# Altium schematic sheet DAC.SchDoc
size A3; SheetNumber: 3; SheetTotal: 8
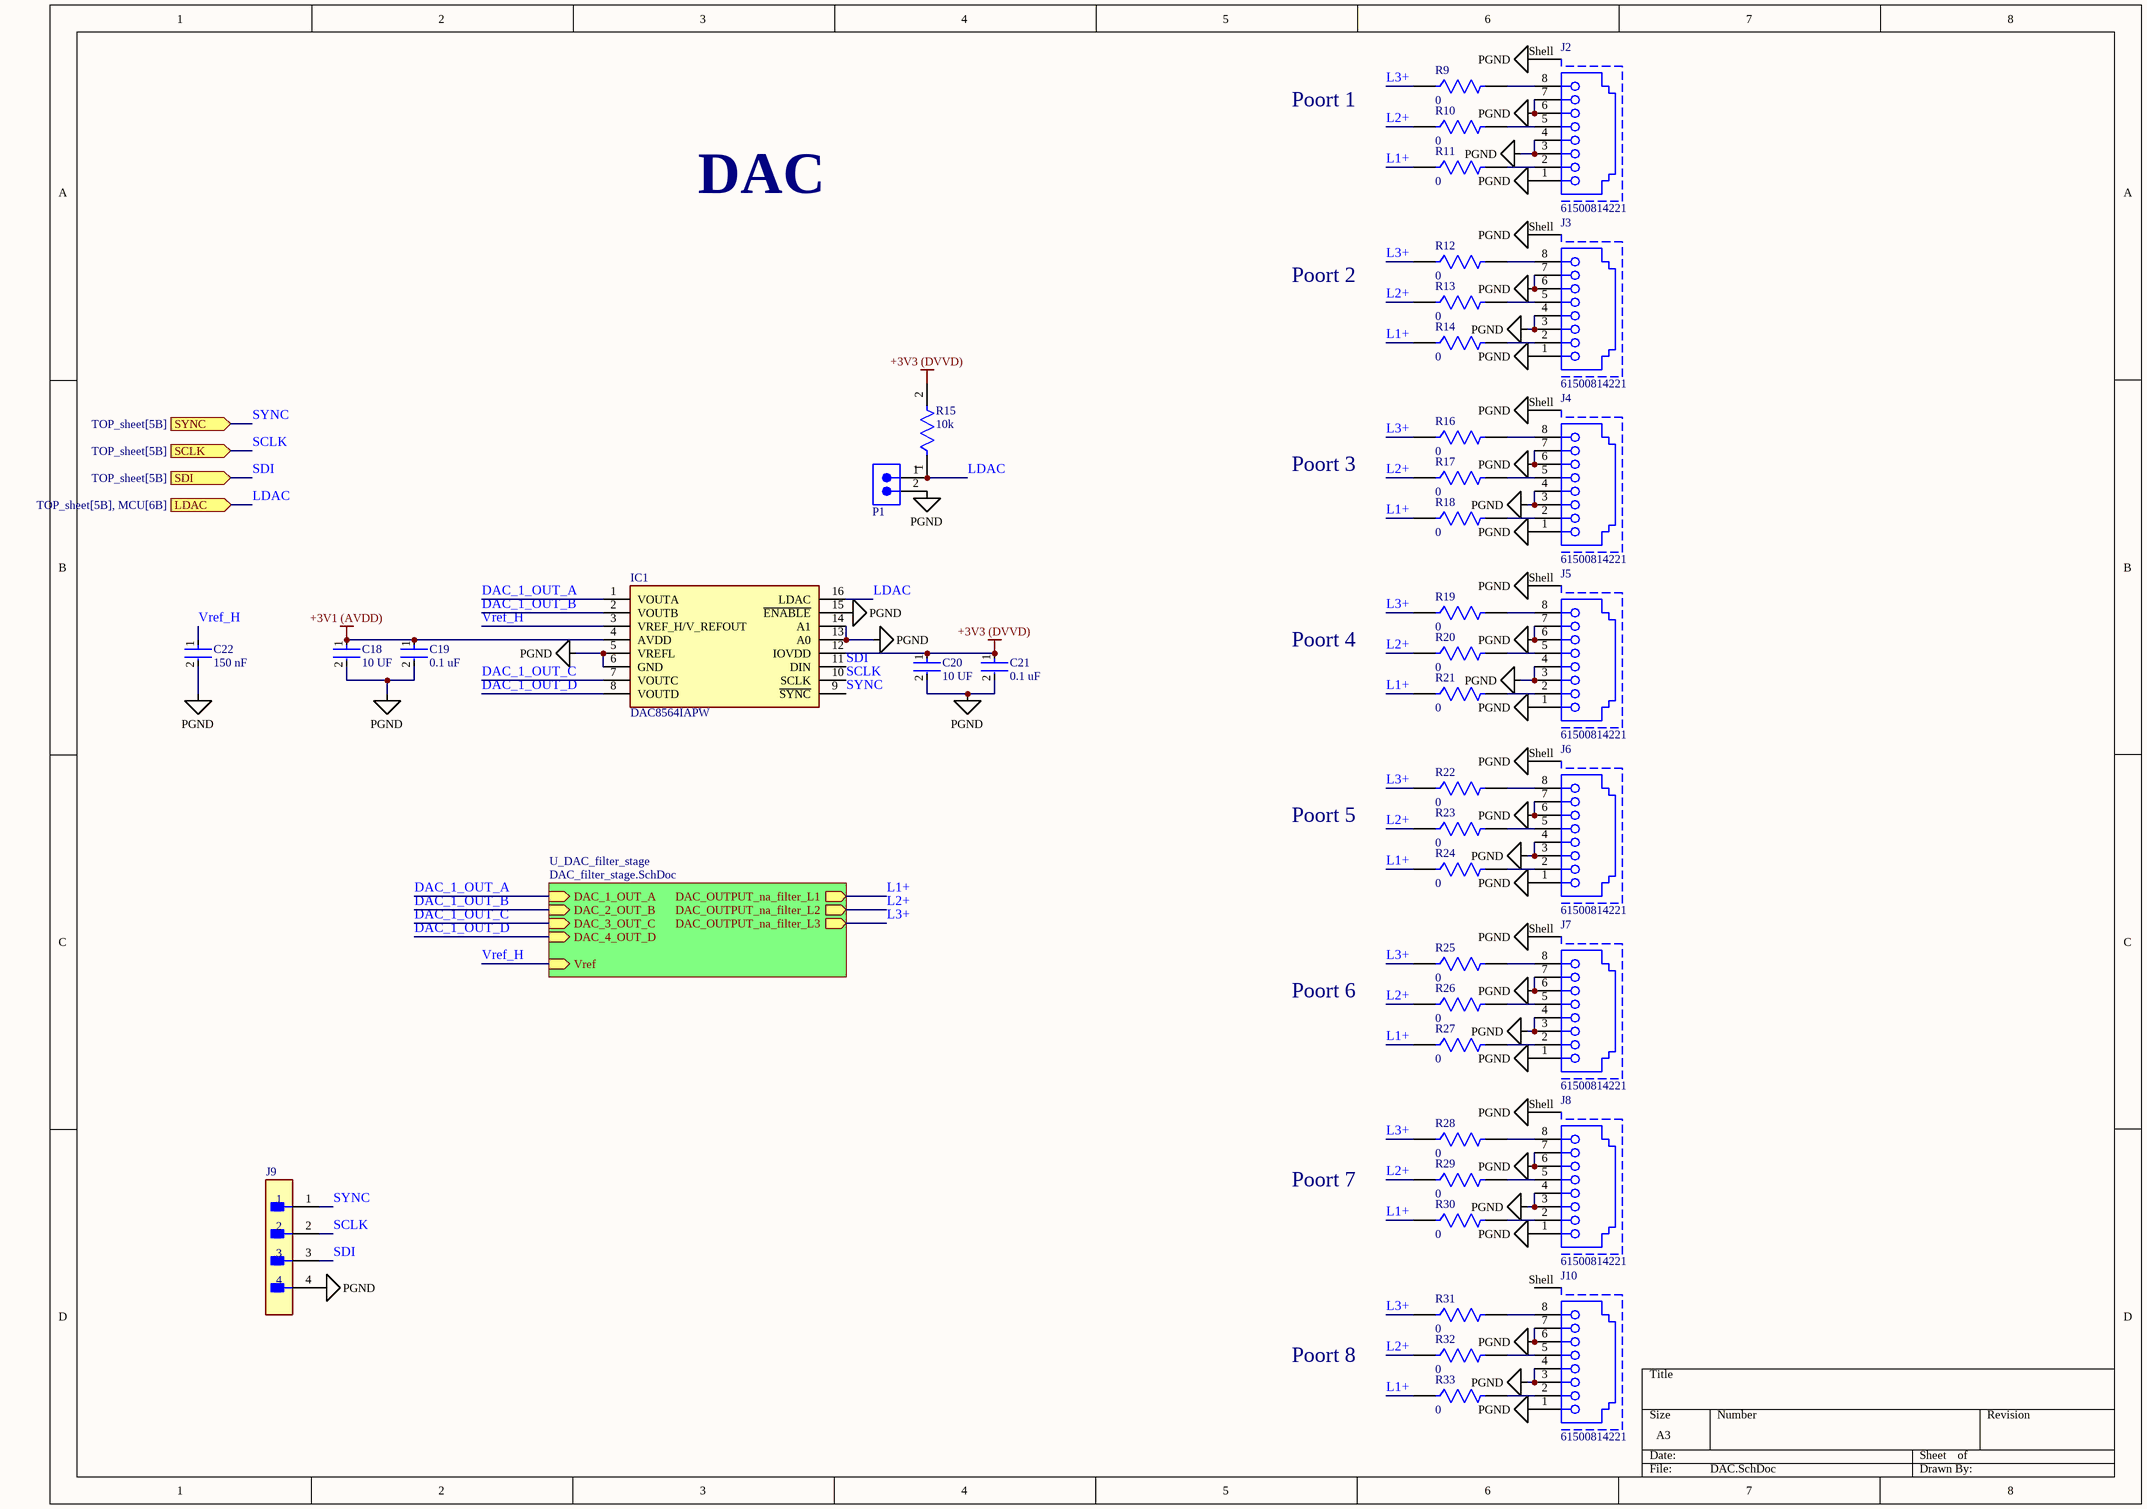
[diagram p0: DAC.SchDoc]

## Parts
C18  10 UF  [FP-CC0603-DA-MFG]
C19  0.1 uF  [FP-CC0603-DA-MFG]
C20  10 UF  [FP-CC0603-DA-MFG]
C21  0.1 uF  [FP-CC0603-DA-MFG]
C22  150 nF  [FP-CC0603-DA-MFG]
IC1  DAC8564IAPW  [SOP65P640X120-16N]
J2  61500814221  [61500814221]
J3  61500814221  [61500814221]
J4  61500814221  [61500814221]
J5  61500814221  [61500814221]
J6  61500814221  [61500814221]
J7  61500814221  [61500814221]
J8  61500814221  [61500814221]
J9  TSW-104-22-G-S  [FP-TSW-104-22-G-S-MFG]  (value not drawn)
J10  61500814221  [61500814221]
P1  TSW-102-26-T-S  [SMTC-TSW-102-26-XX-S]  (value not drawn)
R9  0  [FP-CRCW1206-MFG]
R10  0  [FP-CRCW1206-MFG]
R11  0  [FP-CRCW1206-MFG]
R12  0  [FP-CRCW1206-MFG]
R13  0  [FP-CRCW1206-MFG]
R14  0  [FP-CRCW1206-MFG]
R15  10k  [FP-RC1608-IPC_B]
R16  0  [FP-CRCW1206-MFG]
R17  0  [FP-CRCW1206-MFG]
R18  0  [FP-CRCW1206-MFG]
R19  0  [FP-CRCW1206-MFG]
R20  0  [FP-CRCW1206-MFG]
R21  0  [FP-CRCW1206-MFG]
R22  0  [FP-CRCW1206-MFG]
R23  0  [FP-CRCW1206-MFG]
R24  0  [FP-CRCW1206-MFG]
R25  0  [FP-CRCW1206-MFG]
R26  0  [FP-CRCW1206-MFG]
R27  0  [FP-CRCW1206-MFG]
R28  0  [FP-CRCW1206-MFG]
R29  0  [FP-CRCW1206-MFG]
R30  0  [FP-CRCW1206-MFG]
R31  0  [FP-CRCW1206-MFG]
R32  0  [FP-CRCW1206-MFG]
R33  0  [FP-CRCW1206-MFG]

## Sub-sheets
U_DAC_filter_stage = DAC_filter_stage.SchDoc: DAC_1_OUT_A (in), DAC_2_OUT_B (in), DAC_3_OUT_C (in), DAC_4_OUT_D (in), DAC_OUTPUT_na_filter_L2 (out), DAC_OUTPUT_na_filter_L1 (out), DAC_OUTPUT_na_filter_L3 (out), Vref (in)

## Ports
LDAC (in, see TOP_sheet[5B], MCU[6B]), SCLK (in, see TOP_sheet[5B]), SDI (in, see TOP_sheet[5B]), SYNC (in, see TOP_sheet[5B])

## Nets
+3V1 (AVDD): C18.1 C19.1 IC1.4(AVDD)
+3V3 (DVVD): C20.1 C21.1 IC1.12(IOVDD) R15.2
PGND: C18.2 C19.2 C20.2 C21.2 C22.2 IC1.5(VREFL) IC1.6(GND) IC1.13(A0) IC1.14(A1) IC1.15(~{ENABLE}) J2.1 J2.3 J2.4 J2.6 J2.7 J2.Shell J3.1 J3.3 J3.4 J3.6 J3.7 J3.Shell J4.1 J4.3 J4.4 J4.6 J4.7 J4.Shell J5.1 J5.3 J5.4 J5.6 J5.7 J5.Shell J6.1 J6.3 J6.4 J6.6 J6.7 J6.Shell J7.1 J7.3 J7.4 J7.6 J7.7 J7.Shell J8.1 J8.3 J8.4 J8.6 J8.7 J8.Shell J9.4 J10.1 J10.3 J10.4 J10.6 J10.7 P1.2
DAC_1_OUT_A: IC1.1(VOUTA) ; sheet U_DAC_filter_stage/DAC_1_OUT_A
DAC_1_OUT_B: IC1.2(VOUTB) ; sheet U_DAC_filter_stage/DAC_2_OUT_B
DAC_1_OUT_C: IC1.7(VOUTC) ; sheet U_DAC_filter_stage/DAC_3_OUT_C
DAC_1_OUT_D: IC1.8(VOUTD) ; sheet U_DAC_filter_stage/DAC_4_OUT_D
L1+: R11.1 R14.1 R18.1 R21.1 R24.1 R27.1 R30.1 R33.1 ; sheet U_DAC_filter_stage/DAC_OUTPUT_na_filter_L1
L2+: R10.1 R13.1 R17.1 R20.1 R23.1 R26.1 R29.1 R32.1 ; sheet U_DAC_filter_stage/DAC_OUTPUT_na_filter_L2
L3+: R9.1 R12.1 R16.1 R19.1 R22.1 R25.1 R28.1 R31.1 ; sheet U_DAC_filter_stage/DAC_OUTPUT_na_filter_L3
LDAC: IC1.16(LDAC) P1.1 R15.1 ; port LDAC
SCLK: IC1.10(SCLK) J9.2 ; port SCLK
SDI: IC1.11(DIN) J9.3 ; port SDI
SYNC: IC1.9(~{SYNC}) J9.1 ; port SYNC
Vref_H: C22.1 IC1.3(VREF_H/V_REFOUT) ; sheet U_DAC_filter_stage/Vref
NetJ2_2: J2.2 R11.2
NetJ2_5: J2.5 R10.2
NetJ2_8: J2.8 R9.2
NetJ3_2: J3.2 R14.2
NetJ3_5: J3.5 R13.2
NetJ3_8: J3.8 R12.2
NetJ4_2: J4.2 R18.2
NetJ4_5: J4.5 R17.2
NetJ4_8: J4.8 R16.2
NetJ5_2: J5.2 R21.2
NetJ5_5: J5.5 R20.2
NetJ5_8: J5.8 R19.2
NetJ6_2: J6.2 R24.2
NetJ6_5: J6.5 R23.2
NetJ6_8: J6.8 R22.2
NetJ7_2: J7.2 R27.2
NetJ7_5: J7.5 R26.2
NetJ7_8: J7.8 R25.2
NetJ8_2: J8.2 R30.2
NetJ8_5: J8.5 R29.2
NetJ8_8: J8.8 R28.2
NetJ10_2: J10.2 R33.2
NetJ10_5: J10.5 R32.2
NetJ10_8: J10.8 R31.2

Not connected (* = marked no-connect by the designer): J10 Shell

## Notes on the sheet
- Poort 1
- DAC
- Poort 2
- Poort 3
- Poort 4
- Poort 5
- Poort 6
- Poort 7
- Poort 8

## Library data of the parts
C18 C20 = CMP-2000-05002-2: CAP CER 10 UF 16V X7R 0603; Manufacturer Part Number: CC0603KRX7R7BB104; Manufacturer: YAGEO; Tolerance: 0.1; Value: 100 nF; Temperature Coefficient: 15%; Material: Ceramic; Voltage Rating: 16 V; Package: CC0603-DA; ComponentLink2Description: Datasheet; Octopart: https://octopart.com/cc0603krx7r7bb104-yageo-192941; Temperature Range High: +125°C; Digikey Description: CAP CER 0.1UF 16V X7R 0603; Voltage: 16 V; Device Class L2: Capacitors; Height: 0.9mm; Temperature: -55°C to +125°C; Device Class L1: Passive Components; Device Class L3: Ceramic Capacitors; ComponentLink2URL: http://www.yageo.com/documents/recent/UPY-GPHC_X7R_6.3V-to-50V_18.pdf; Footprint Url: http://www.yageo.com/exep/pages/download/literatures/UPY-C_GEN_24.pdf; RoHS: TRUE; Temperature Range Low: -55°C; Temperature Characteristic: X7R; Lead Free: Yes; Capacitance: 100 nF; Category: Cap; Mouser Description: Multilayer Ceramic Capacitor, CC Series, 0.1 - F, - 10%, X7R, 16 V, 0603 [1608 Metric]; Automotive: No
C19 C21 C22 = CMP-2000-05002-2: CAP CER 0.1UF 16V X7R 0603; Manufacturer Part Number: CC0603KRX7R7BB104; Manufacturer: YAGEO; Tolerance: 0.1; Value: 100 nF; Temperature Coefficient: 15%; Material: Ceramic; Voltage Rating: 16 V; Package: CC0603-DA; ComponentLink2Description: Datasheet; Octopart: https://octopart.com/cc0603krx7r7bb104-yageo-192941; Temperature Range High: +125°C; Digikey Description: CAP CER 0.1UF 16V X7R 0603; Voltage: 16 V; Device Class L2: Capacitors; Height: 0.9mm; Temperature: -55°C to +125°C; Device Class L1: Passive Components; Device Class L3: Ceramic Capacitors; ComponentLink2URL: http://www.yageo.com/documents/recent/UPY-GPHC_X7R_6.3V-to-50V_18.pdf; Footprint Url: http://www.yageo.com/exep/pages/download/literatures/UPY-C_GEN_24.pdf; RoHS: TRUE; Temperature Range Low: -55°C; Temperature Characteristic: X7R; Lead Free: Yes; Capacitance: 100 nF; Category: Cap; Mouser Description: Multilayer Ceramic Capacitor, CC Series, 0.1 - F, - 10%, X7R, 16 V, 0603 [1608 Metric]; Automotive: No
IC1 = DAC8564IAPW: Integrated Circuit; Manufacturer_Name: Texas Instruments; Datasheet Link: http://www.ti.com/lit/gpn/dac8564; Height: 1.2mm; Manufacturer_Part_Number: DAC8564IAPW; Mouser Part Number: 595-DAC8564IAPW; Mouser Price/Stock: https://www.mouser.co.uk/ProductDetail/Texas-Instruments/DAC8564IAPW?qs=xL7PkI2RoJ7hkn2IPLSbKw%3D%3D; Arrow Part Number: DAC8564IAPW; Arrow Price/Stock: https://www.arrow.com/en/products/dac8564iapw/texas-instruments?region=nac
J2-J8 J10 = CMP-1502-01695-2: NexarPartId: 8917800; Number of Contacts: 8; Operating Supply Voltage: 120V; Gender: Female; Contact Resistance: 20mΩ; Number of Ports: 1; Direction: Down; Shielding: Shielded; Insulation Resistance: 500MΩ; Current Rating: 1.5A; Connector Type: RJ45, Socket; Mount: PCB, Through Hole; Housing Material: PBT; RoHS: Compliant; Depth: 21.2mm; Max Operating Temperature: 85°C; Contact Material: Copper; REACH SVHC: Unknown; Voltage Rating (DC): 120V; Orientation: Right Angle; Number of Positions: 8; Number of Rows: 1; Insulation Material: PBT; Width: 15.88mm; Flammability Rating: UL94 V-0; Termination: Through Hole; Min Operating Temperature: -40°C; Voltage Rating (AC): 120V; Length: 13.65mm; Height: 19.95mm; Contact Plating: Gold; Color: Black
J9 = CMP-02766-001236-1: GENERIC PART NUMBER: GPHA-1X04 / CONN HEADER VERT 4POS 2.54MM; Number of Contacts: 4; Gender: Male; Termination: Solder; Pitch: 2.54mm; Mount: Through Hole; Number of Rows: 1; Packaging: Bulk; Contact Material: Bronze; Contact Plating: Gold; REACH SVHC: No SVHC; Radiation Hardening: No; GENERIC PART NUMBER: GPHA-1X04
P1 = CMP-1024-00328-1: 0.025" SQ Post Header, Through-hole, Vertical, -55 to 105 degC, 2.54 mm Pitch, 2-Pin, Male, RoHS; Manufacturer: Samtec; Pitch: 2.54 mm; PackageReference: TSW-102-26-XX-S; ComponentLink1URL: http://www.samtec.com; ComponentLink3Description: Package Specification; ComponentLink3URL: http://www.samtec.com/documents/webfiles/cpdf/TSW-XXX-XX-XXX-X-XX-XXX-MKT.pdf; DatasheetVersion: F-214; ComponentLink2URL: http://www.samtec.com/documents/webfiles/pdf/TSW_TH.PDF; Mounting Technology: Through-hole; ComponentLink2Description: Datasheet; PartNumber: TSW-102-26-T-S; ComponentLink1Description: Manufacturer URL; PackageDescription: .025[0.64] SQ. Post Terminal Strip Assembly; Orientation: Vertical; PackageVersion: DM, 8/1988; Temperature Range: -55 to 105 degC; RoHS: True
R9-R14 R16-R33 = CMP-00030-39388935-1: CRCW12060000ZSTA Zero Ohm Resistor, Jumper, 1206 [3216 Metric], Thick Film, 250 mW, Surface Mount; Voltage Rating (DC): 200V; Max Power Dissipation: 250mW; Temperature Coefficient: 100ppm/°C; Resistance: 0Ω; Packaging: Cut Tape; Lead Free: Contains Lead; Height: 609.6µm; Military Standard: Not; Min Operating Temperature: -55°C; Weight: 10.007382mg; Depth: 1.6mm; Termination: SMD/SMT; Mount: Surface Mount; RoHS: Compliant; Case Code (Metric): 3216; Max Operating Temperature: 155°C; NexarPartId: 39388935; Length: 3.2mm; Features: Automotive AEC-Q200; Case Code (Imperial): 1206; Composition: Thick Film; Case/Package: 1206; Voltage Rating: 200V; Width: 1.6mm; Contact Plating: Lead, Tin; Number of Terminations: 2; REACH SVHC: Unknown; Power Rating: 250mW; Radiation Hardening: No
R15 = CMP-13261-004935-1: Res Thick Film 0603 11kΩ 1% 0.1W ±100ppm/°C Molded SMD T/R; Generic part Eurocircuits:: GPR060311K; Resistance: 11k; Voltage Rating (DC): 50V; Power Rating: 100mW; Contact Plating: Tin; Depth: 0.8mm; Width: 800um; Tolerance: 1%; Lead Free: Lead Free; Composition: Thick Film; Military Standard: Not; Temperature Coefficient: 100ppm/°C; Radiation Hardening: No; Length: 1.6mm; Case/Package: 0603; Max Operating Temperature: 155°C; Packaging: Tape and Reel; Min Operating Temperature: -55°C